# Altium schematic sheet PDM-S12-V00-InputProtection.SchDoc: Digital Input Protection
size A3; DrawnBy: Zoe Goodward; Organization: QUT Motorsport; Address1: O-120, Gardens Point; Address2: 2 George Street; Address3: Brisbane, QLD 4000; Address4: Australia; DocumentNumber: ####; Revision: 00; SheetNumber: 1; SheetTotal: 1; Version: 00; Project: Power Distribution Module; PageSetup: Record=PageOptions|CenterHorizontal=True|CenterVertical=True|PrintScale=0.97|XCorrection=1.00|YCorrection=1.00|PrintKind=0|BorderSize=5000000|LeftOffset=0|BottomOffset=0|Orientation=2|PaperLength=1000|PaperWidth=1000|Scale=100|PaperSource=7|PrintQuality=-4|MediaType=1|DitherType=10|PaperKind=A4|PrintScaleMode=1
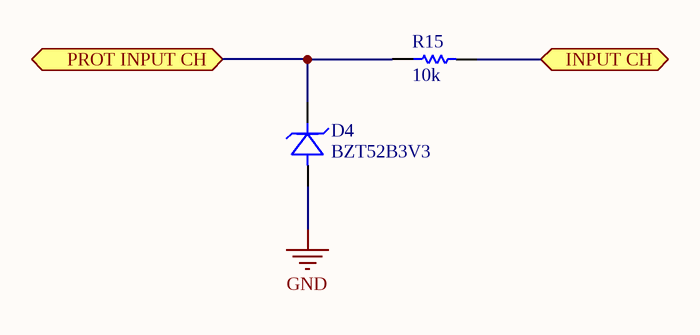
[diagram p0: PDM-S12-V00-InputProtection.SchDoc]

## Parts
D4  BZT52B3V3  [SOD123]
R15  10k  [Res_ThinFilm_0603]

## Ports
INPUT CH (bidir), PROT INPUT CH (bidir)

## Nets
GND: D4.A(Anode)
INPUT CH: R15.2 ; port INPUT CH
PROT INPUT CH: D4.K(Cathode) R15.1 ; port PROT INPUT CH

## Notes on the sheet
- Revision History:
- Sheet Title:
- Rev
- Date
- Description
- Project:
- Size:
- Drawn By:
- A3
- Number:
- Revision:
- Sheet
- Version:
- of
- QUT Motorsport
- O-120, Gardens Point
- 2 George Street
- Brisbane, QLD 4000
- Australia
- Print Date:
- Print Time:
- File Name:

## Library data of the parts
D4 = BZT52B3V3: Diode, SMD, Zener, 3.3V, 2%, 410mW, SOD-123; ComponentLink1Description: Datasheet; ComponentLink1URL: https://www.vishay.com/docs/85760/bzt52.pdf; ComponentLink2Description: Digikey; ComponentLink2URL: https://www.digikey.com/product-detail/en/vishay-semiconductor-diodes-division/BZT52B3V3-E3-08/112-BZT52B3V3-E3-08CT-ND/8564806
R15 = 10k 5% 0603: Resistor, SMD, 10k, 0.1W, 5%, 0603